# Altium schematic sheet raspberry_interface.SchDoc
size A
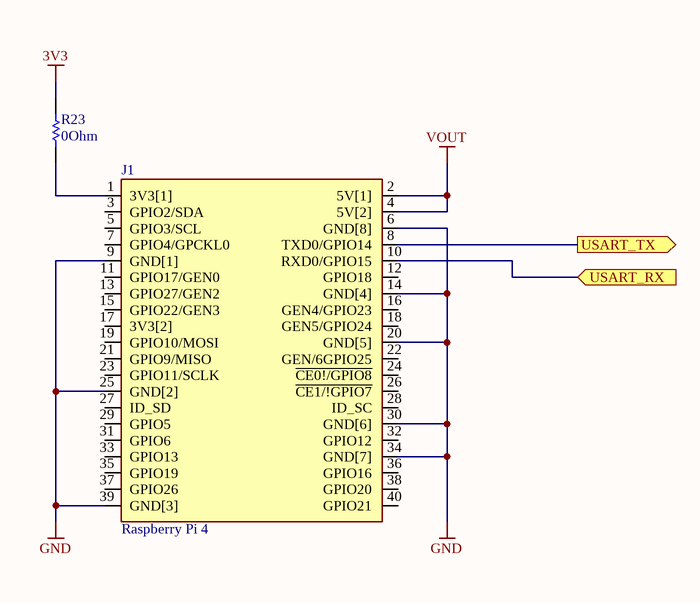
[diagram p0: raspberry_interface.SchDoc]

## Parts
J1  Raspberry Pi 4  [40P_HEADER]
R23  0Ohm  [RES_0804]

## Ports
USART_RX (in), USART_TX (out)

## Nets
3V3: R23.2
GND: J1.6(GND[8]) J1.9(GND[1]) J1.14(GND[4]) J1.20(GND[5]) J1.25(GND[2]) J1.30(GND[6]) J1.34(GND[7]) J1.39(GND[3])
VOUT: J1.2(5V[1]) J1.4(5V[2])
USART_RX: J1.10(RXD0/GPIO15) ; port USART_RX
USART_TX: J1.8(TXD0/GPIO14) ; port USART_TX
NetJ1_1: J1.1(3V3[1]) R23.1

Not connected (* = marked no-connect by the designer): J1 3(GPIO2/SDA) 5(GPIO3/SCL) 7(GPIO4/GPCKL0) 11(GPIO17/GEN0) 12(GPIO18) 13(GPIO27/GEN2) 15(GPIO22/GEN3) 16(GEN4/GPIO23) 17(3V3[2]) 18(GEN5/GPIO24) 19(GPIO10/MOSI) 21(GPIO9/MISO) 22(GEN/6GPIO25) 23(GPIO11/SCLK) 24(~{CE0!/GPIO8}) 26(~{CE1/!GPIO7}) 27(ID_SD) 28(ID_SC) 29(GPIO5) 31(GPIO6) 32(GPIO12) 33(GPIO13) 35(GPIO19) 36(GPIO16) 37(GPIO26) 38(GPIO20) 40(GPIO21)

## Library data of the parts
J1 = RASPBERRY_PI4: Raspberry Pi 4 with Headers_; MP: ADA3708; Availability: Unavailable; Package: None; MF: Raspberry Pi; Value: *; Price: None; SnapEDA_Link: https://www.snapeda.com/parts/ADA3708/Raspberry%20Pi/view-part/2770118/?ref=snap
R23 = RES_0R: Part Number: CRCW120647K0FKEA; Manufacturer: Vishay Dale